# Altium schematic sheet VUE_PIC32_v1_0_Supplies.SchDoc: [VUE32 - Supplies]
size A4; Engineer: JFDuval; Revision: 1.0
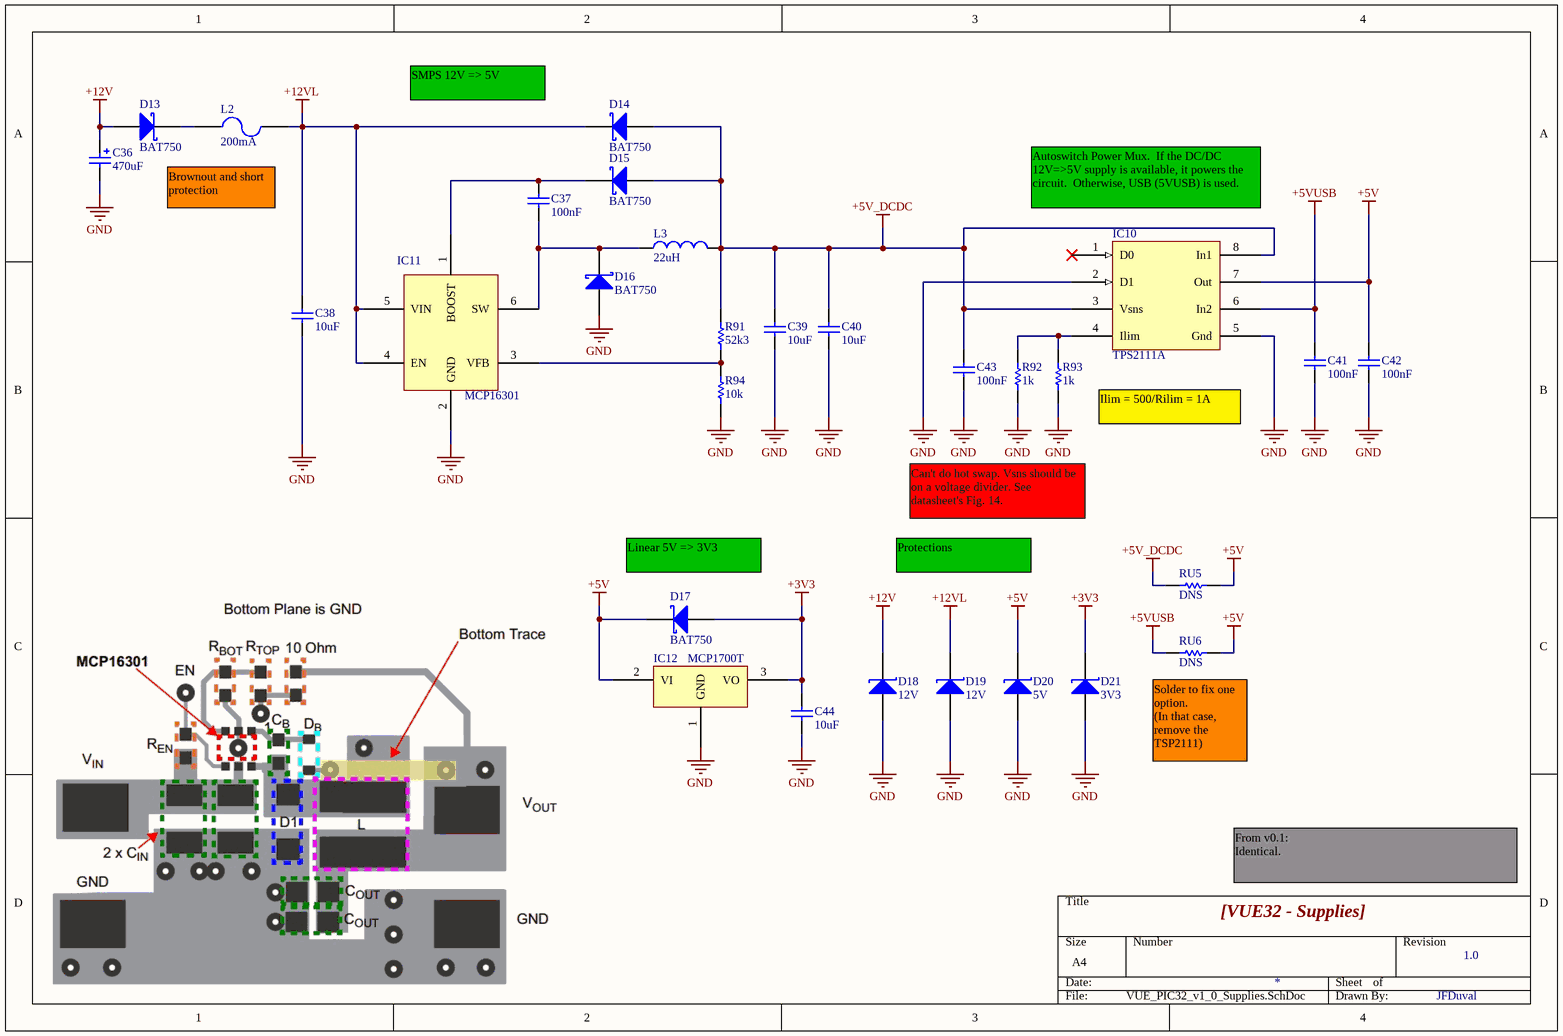
[diagram p0: VUE_PIC32_v1_0_Supplies.SchDoc]

## Parts
C36  470uF  [CAP_8D_15H_3_5mm]
C37  100nF  [0402C]
C38  10uF  [0805C]
C39  10uF  [0805C]
C40  10uF  [0805C]
C41  100nF  [0402C]
C42  100nF  [0402C]
C43  100nF  [0402C]
C44  10uF  [0805C]
D13  BAT750  [SOT23-3]
D14  BAT750  [SOT23-3]
D15  BAT750  [SOT23-3]
D16  BAT750  [SOT23-3]
D17  BAT750  [SOT23-3]
D18  value 12V  [SMA]  (hidden comment: SMA)
D19  value 12V  [SMA]  (hidden comment: SMA)
D20  5V  [Micro-SMP]
D21  3V3  [Micro-SMP]
IC10  TPS2111A  [TSSOP-8]
IC11  MCP16301  [SOT23-6]
IC12  MCP1700T  [SOT89-3]
L2  200mA  [1206_PTC]
L3  22uH  [1812L]
R91  52k3  [0402]
R92  value 1k  [0402]  (hidden comment: DNS)
R93  value 1k  [0402]  (hidden comment: DNS)
R94  10k  [0402]
RU5  DNS  [0603]
RU6  DNS  [0603]

## Nets
+3V3: C44.2 D17.1(A) D21.K IC12.3(VO)
+5V: C42.2 D17.3(K) D20.K IC10.7(Out) IC12.2(VI) RU5.2 RU6.2
+5V_DCDC: C39.2 C40.2 C43.2 D14.1(A) D15.1(A) IC10.3(Vsns) IC10.8(In1) L3.2 R91.2 RU5.1
+5VUSB: C41.2 IC10.6(In2) RU6.1
+12V: C36.A D13.1(A) D18.K
+12VL: C38.2 D14.3(K) D19.K IC11.4(EN) IC11.5(VIN) L2.2
GND: C36.K C38.1 C39.1 C40.1 C41.1 C42.1 C43.1 C44.1 D16.1(A) D18.A D19.A D20.A D21.A IC10.2(D1) IC10.5(Gnd) IC11.2(GND) IC12.1(GND) R92.1 R93.1 R94.1
NetC37_1: C37.1 D16.3(K) IC11.6(SW) L3.1
NetC37_2: C37.2 D15.3(K) IC11.1(BOOST)
NetD13_3: D13.3(K) L2.1
NetIC10_4: IC10.4(Ilim) R92.2 R93.2
NetIC11_3: IC11.3(VFB) R91.1 R94.2

Not connected (* = marked no-connect by the designer): IC10 1(D0)*

## Notes on the sheet
- SMPS 12V => 5V
- Brownout and short protection
- (near IC10) Autoswitch Power Mux.  If the DC/DC 12V=>5V supply is available, it powers the circuit.  Otherwise, USB (5VUSB) is used.
- Ilim = 500/Rilim = 1A
- Can't do hot swap. Vsns should be on a voltage divider. See datasheet's Fig. 14.
- (near D17) Linear 5V => 3V3
- Protections
- (near RU6) Solder to fix one option.
  (In that case, remove the TSP2111)
- From v0.1:
  Identical.

## Library data of the parts
C36 = CAP_UNITED_470UF_16V: CAP ALUM 470UF 16V 20% RADIAL; MfgPartNumber: EKY-160ELL471MH15D; Mfg: Panasonic - ECG; Digikey: 565-1524-ND; Value: 470uF
C37 C41-C43 = CAP_TDK_C_0402_100nF_25V: CAP CER 0.1UF 25V Y5V 0402; MfgPartNumber: C1005Y5V1E104Z; Mfg: TDK; Value: 100nF; Digikey: 445-3445-1-ND
C38-C40 C44 = CAP_MURATA_C_0805_10uF_16V: CAP CER 10UF 16V Y5V 0805; MfgPartNumber: GRM21BF51C106ZE15L; Mfg: Murata; Digikey: 490-3347-1-ND; Value: 10uF
D13-D17 = DIODE_DIODESINC_BAT750_SCHOTTKY_SOT23_40V_750MA: DIODE SCHOTTKY 40V 750MA SOT23-3; MfgPartNumber: BAT750TA; Mfg: Diodes/Zetex; Digikey: BAT750CT-ND; Value: BAT750
D18 D19 = DIODE_BOURNS_SMAJ12A_TVS_SMA_12V_400W: DIODE TVS 12V 400W UNI 5% SMD; Mfg: Bourns Inc.; MfgPartNumber: SMAJ12A; Digikey: SMAJ12ABCT-ND
D20 = DIODE_VISHAY_MSP5_TVS_MICROSMP_5V_100W: TVS UNIDIR 100W 5.0V MICROSMP; MfgPartNumber: MSP5.0A-M3/89A; Mfg: Vishay/General Semiconductor; Value: 5V; Digikey: MSP5.0A-M3/89AGICT-ND
D21 = DIODE_VISHAY_MSP3V3_TVS_MICROSMP_3V3_100W: TVS UNIDIR 100W 3.3V MICROSMP; MfgPartNumber: MSP3V3-M3/89A; Mfg: Vishay/General Semiconductor; Value: 3V3; Digikey: MSP3V3-M3/89AGICT-ND
IC10 = IC_PMIC_TI_TPS2111_AUTOSWITCH_POWER_MUX: IC AUTOSWITCH POWER MUX 8-TSSOP; MfgPartNumber: TPS2111APWR; Mfg: Texas Instruments; Value: TPS2111A; Digikey: 296-16936-1-ND
IC11 = IC_DCDC_MICROCHIP_MCP16301: IC REG BUCK ADJ 0.6A SOT23-6; MfgPartNumber: MCP16301T-I/CHY; Mfg: Microchip Technology; Value: MCP16301; Digikey: MCP16301T-I/CHYCT-ND
IC12 = IC_REG_MICROCHIP_MCP1700_3V3_SOT89: IC REG LDO 3.3V 250MA SOT-89-3; MfgPartNumber: MCP1700T-3302E/MB; Mfg: Microchip Technology; Value: MCP1700T; Digikey: MCP1700T3302EMBCT-ND
L2 = PTC_BELFUSE_200MA_30V_50MS_1206: PTC RESTTBLE 0.20A 30V CHIP 1206; MfgPartNumber: 0ZCA0020FF2E; Mfg: Bel Fuse Inc; Value: 200mA; Digikey: 507-1478-1-ND
L3 = L_WURTH_22uH_630MA_1812: INDUCTOR WW 22UH .63A 1812 SMD; MfgPartNumber: 744045220; Mfg: Wurth Electronics Inc; Value: 22uH; Digikey: 732-3074-1-ND
R91 = RES_PANASONIC_0402_52K3_1PCT: RES 52.3K OHM 1/10W 1% 0402 SMD; MfgPartNumber: ERJ-2RKF5232X; Mfg: Panasonic - ECG; Value: 52k3; Digikey: P52.3KLCT-ND
R92 R93 = RES_YAGEO_0402_1K_1PCT: RES 1.00K OHM 1/16W 1% 0402 SMD; MfgPartNumber: RC0402FR-071KL; Mfg: Yageo; Digikey: 311-1.00KLRCT-ND
R94 = RES_YAGEO_0402_10K_1PCT: RES 10.0K OHM 1/16W 1% 0402 SMD; MfgPartNumber: RC0402FR-0710KL; Mfg: Yageo; Value: 10k; Digikey: 311-10.0KLRCT-ND
RU5 RU6 = RES_DO_NOT_SOLDER_DNS_0603: Optional jumper - Do Not Solder; Mfg: NULL; MfgPartNumber: NULL; Digikey: NULL; Value: DNS